# EAGLE design QuadPortIEC (EAGLE 7.7.0)
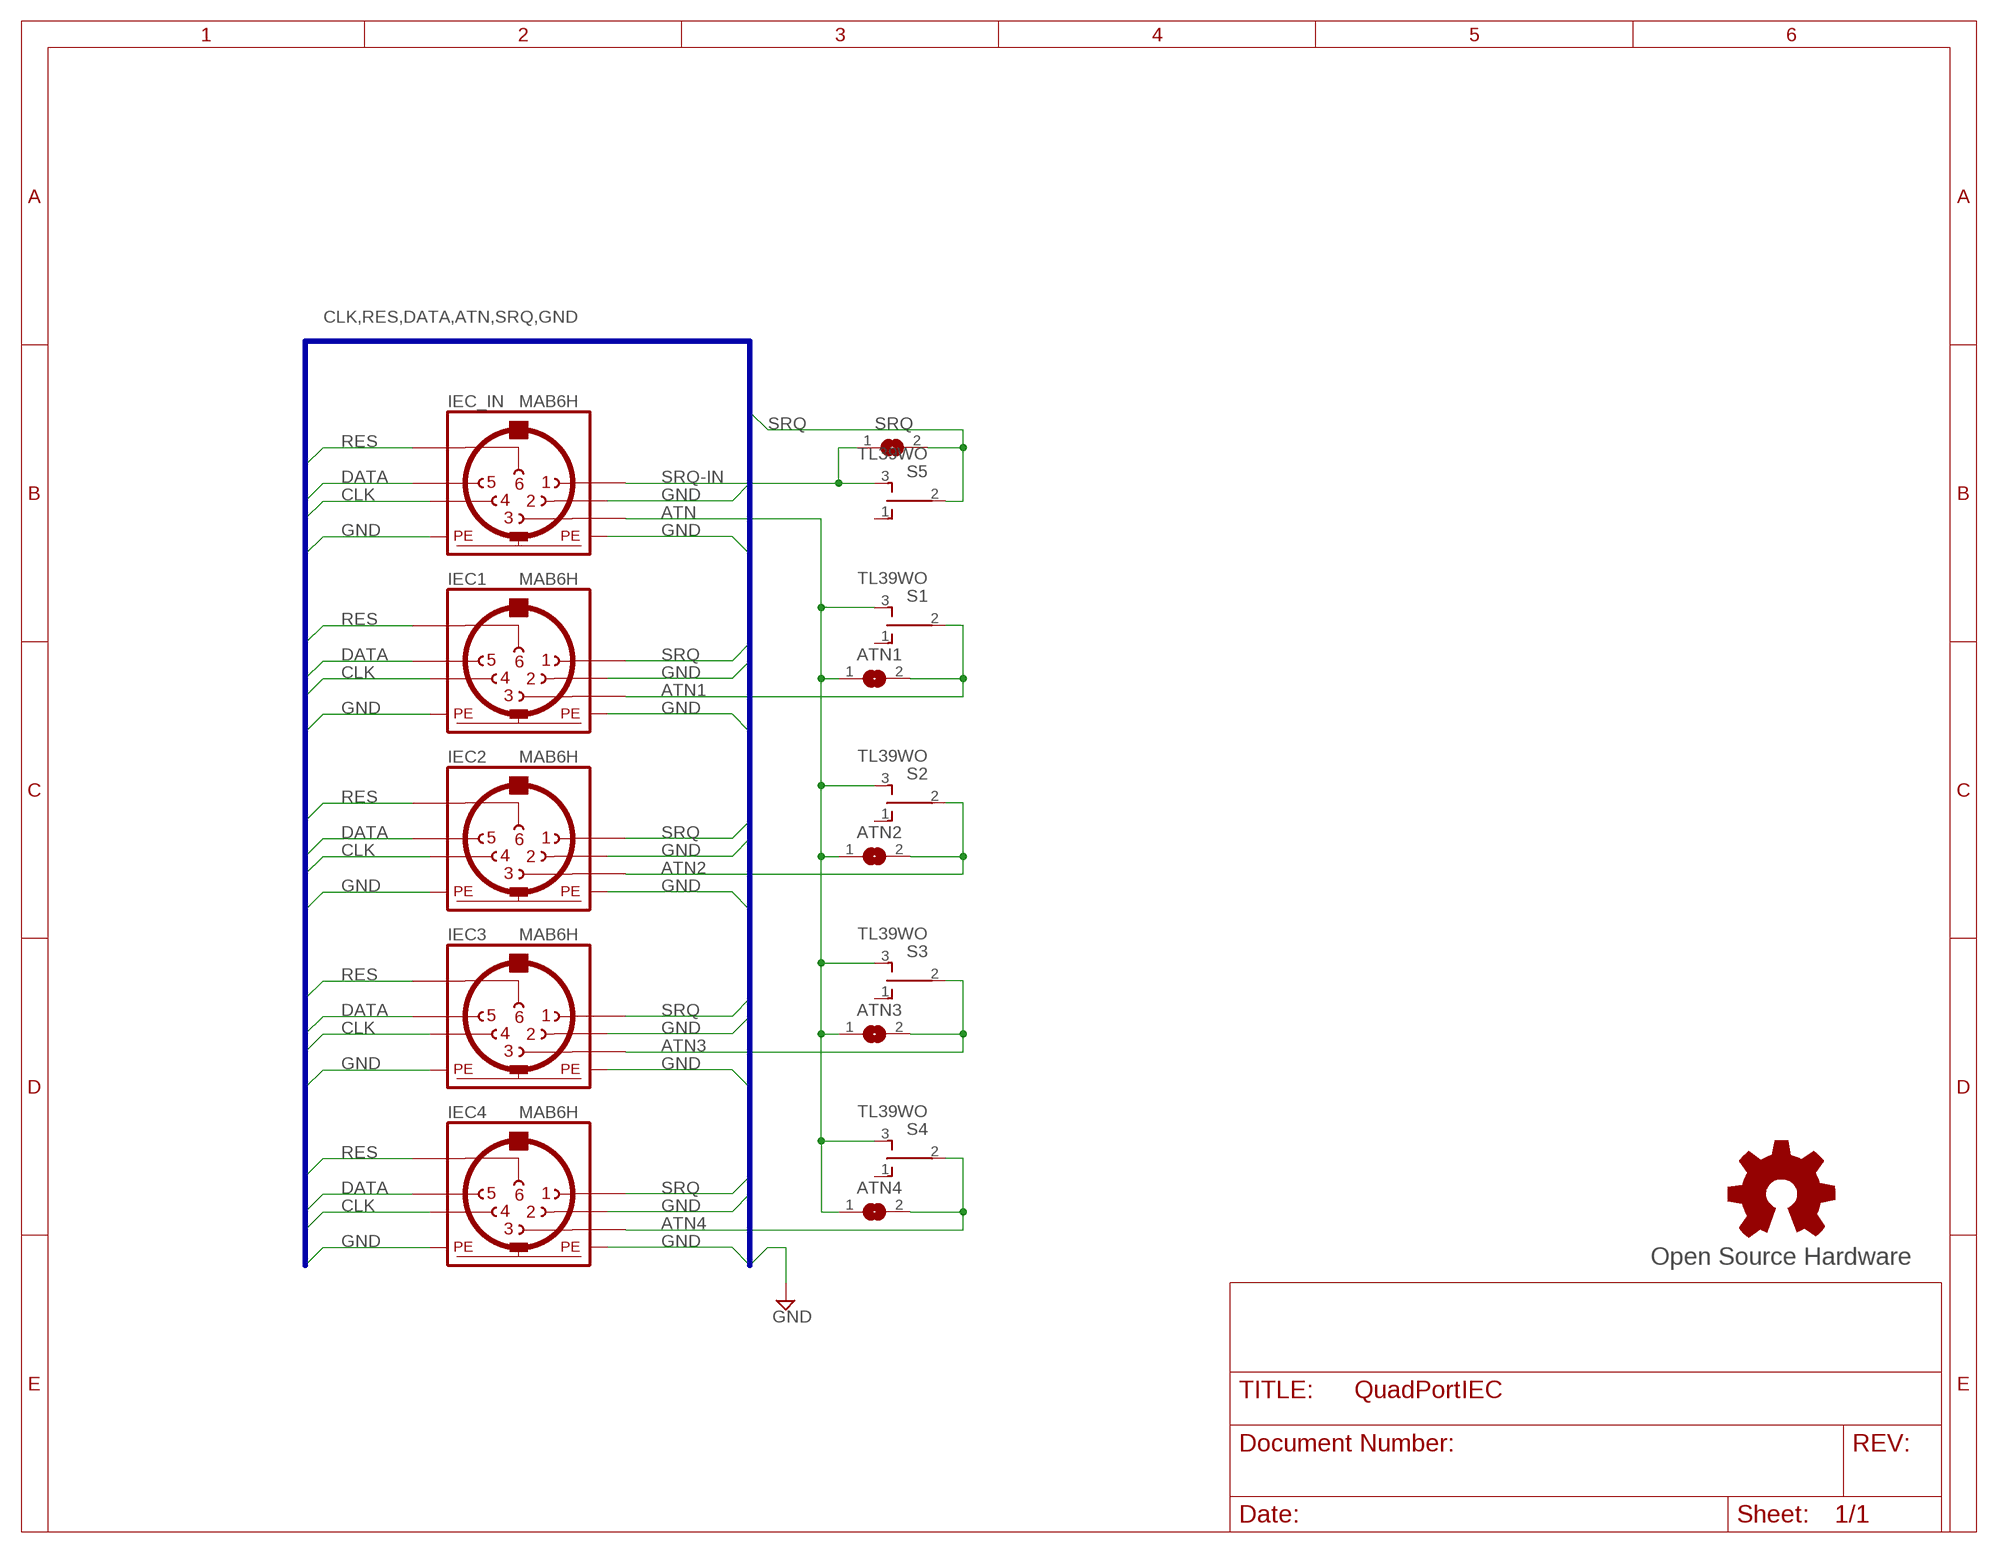
[diagram p0: schematic, sheet 1]

## Parts
ATN1  SJ  [SJ]
ATN2  SJ  [SJ]
ATN3  SJ  [SJ]
ATN4  SJ  [SJ]
GOLD_ORB_SM1  Open Source Hardware  OSHWLOGOLOGO8MM  [OSHW_8MM]
IEC1  MAB6H  [MAB6H]
IEC2  MAB6H  [MAB6H]
IEC3  MAB6H  [MAB6H]
IEC4  MAB6H  [MAB6H]
IEC_IN  MAB6H  [MAB6H]
S1  TL39WO  [TL3XWO]
S2  TL39WO  [TL3XWO]
S3  TL39WO  [TL3XWO]
S4  TL39WO  [TL3XWO]
S5  TL39WO  [TL3XWO]
SRQ  SJ  [SJ]

## Nets
ATN: ATN1.1 ATN2.1 ATN3.1 ATN4.1 IEC_IN.3 S1.3(S) S2.3(S) S3.3(S) S4.3(S)
ATN1: ATN1.2 IEC1.3 S1.2(P)
ATN2: ATN2.2 IEC2.3 S2.2(P)
ATN3: ATN3.2 IEC3.3 S3.2(P)
ATN4: ATN4.2 IEC4.3 S4.2(P)
CLK: IEC1.4 IEC2.4 IEC3.4 IEC4.4 IEC_IN.4
DATA: IEC1.5 IEC2.5 IEC3.5 IEC4.5 IEC_IN.5
GND: IEC1.2 IEC1.PE IEC1.PE@(PE) IEC2.2 IEC2.PE IEC2.PE@(PE) IEC3.2 IEC3.PE IEC3.PE@(PE) IEC4.2 IEC4.PE IEC4.PE@(PE) IEC_IN.2 IEC_IN.PE IEC_IN.PE@(PE)
RES: IEC1.6 IEC2.6 IEC3.6 IEC4.6 IEC_IN.6
SRQ: IEC1.1 IEC2.1 IEC3.1 IEC4.1 S5.2(P) SRQ.2
SRQ-IN: IEC_IN.1 S5.3(S) SRQ.1
Unconnected: S1.1(O) S2.1(O) S3.1(O) S4.1(O) S5.1(O)

## Buses
CLK,RES,DATA,ATN,SRQ,GND

## Library data of the parts
ATN1-ATN4 SRQ = jumper:SJ: SMD solder JUMPER
GOLD_ORB_SM1 = oshw:OSHWLOGO: The OSHW logo for PCB layout
IEC1-IEC4 IEC_IN = con-hirschmann:MAB6H: Female CONNECTOR 6 pins with shield, horizontal (DIN 45322)
S1-S5 = switch:TL39WO: TINY SWITCH ON OFF ON Source: http://www2.produktinfo.conrad.com/datenblaetter/700000-724999/705152-da-01-de-Subminiaturschalter_TL_36WO.pdf

## Board
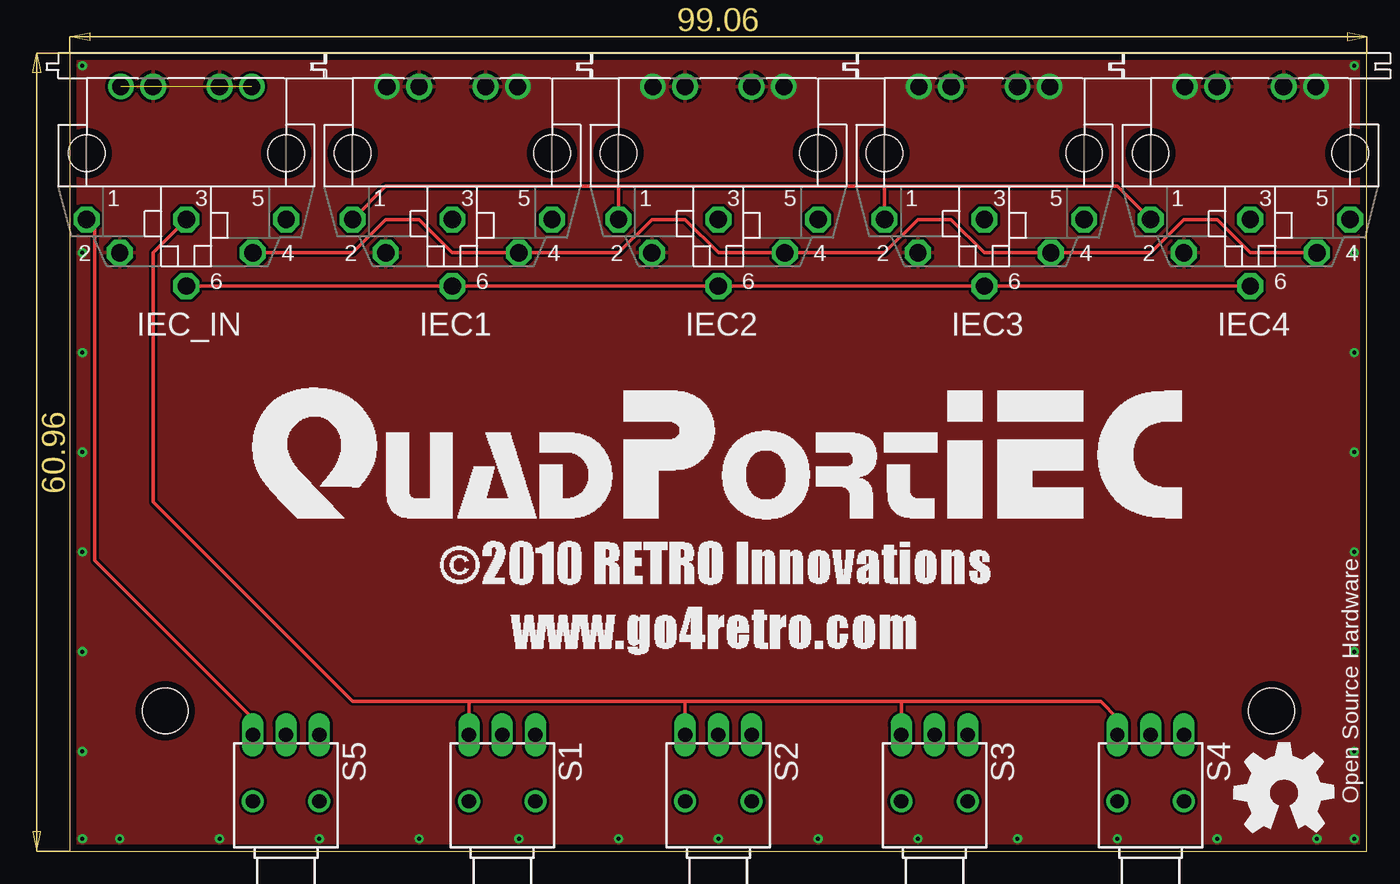
[diagram p1: board, top side]
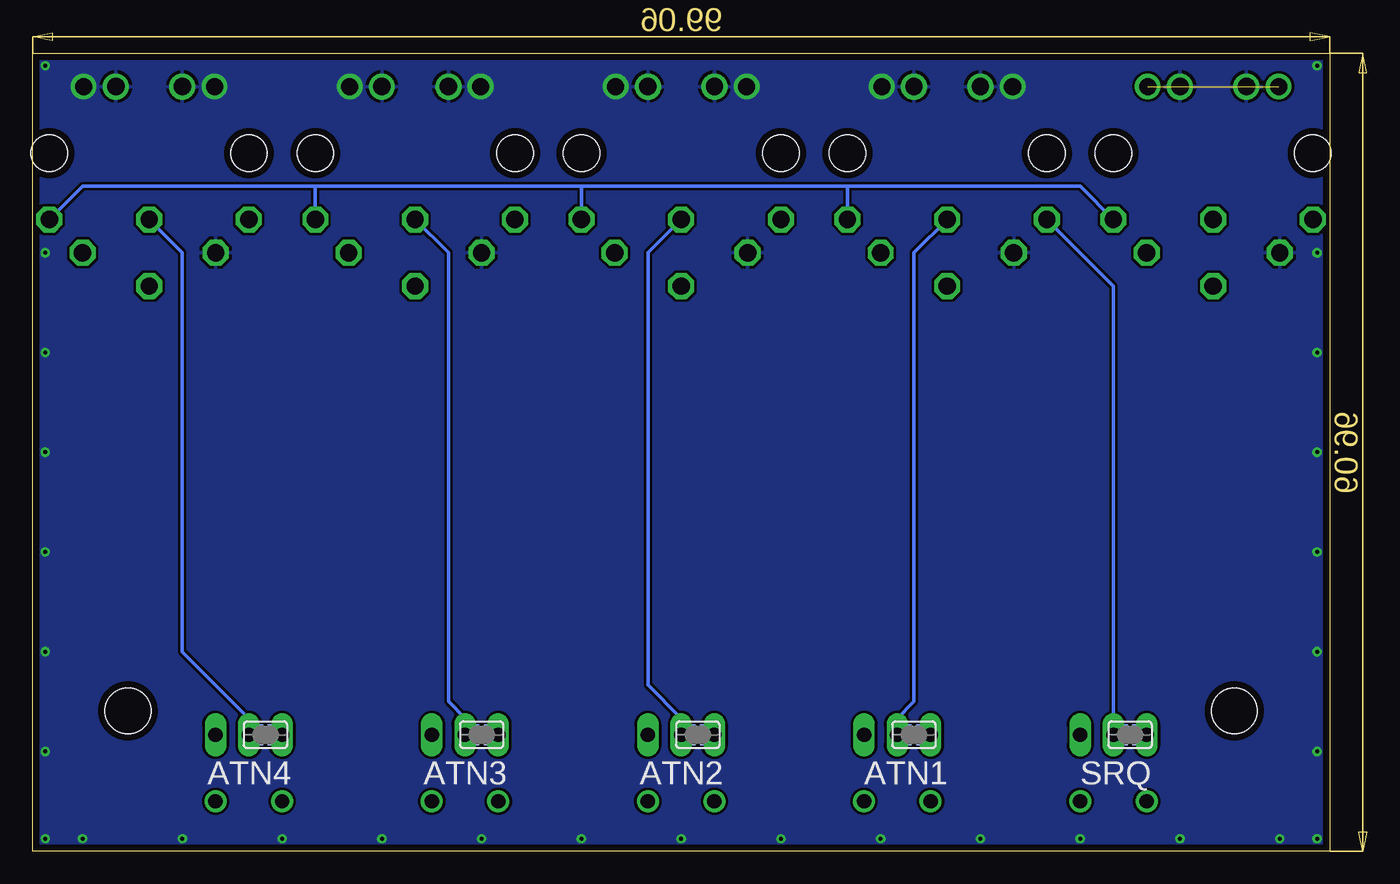
[diagram p2: board, bottom side, seen from below]

Size 99.06 x 60.96 mm. Coordinates in mm from the lower left corner, seen from the top.
Outline: 99.06,60.96 0,60.96 0,0 99.06,0.01 99.06,60.96
Copper layers (1*16): Top 0.035mm / dielectric 1.5mm / Bottom 0.035mm
Design rules "default *": minimum track width 10mil, minimum drill 12mil, track to track 8mil, track to pad 8mil, pad to pad 8mil, via to via 8mil, smd to smd 8mil, copper to edge 20mil, drill to drill 8mil, minimum pad ring 10mil, minimum via ring 8mil, stop-mask expansion 4mil, vias tented up to drill 0mil, thermal gap 10mil
Holes 3.51 mm at 91.78,10.73 7.28,10.73

### Footprints (pad centres in the part's own frame; a part is rotated, then mirrored left to right if it is on the bottom)
SJ = smd 1.168 x 1.6: 1 -0.762,0; 2 0.762,0
MAB6H = drill 1.321 octagon: 1 7.62,5.08; 2 5.08,7.62; 3 0,5.08; 4 -5.08,7.62; 5 -7.62,5.08; 6 0,10.16 | drill 1.321: PE -2.54,-5.08; PE@ 2.54,-5.08 | hole 2.794: 7.62,0; -7.62,0
TL3XWO = drill 1.1 pad 1.422 long: 1 -2.54,-5.08; 2 0,-5.08; 3 2.54,-5.08 | drill 1.1 pad 1.676: M1 -2.54,0; M2 2.54,0

### Placement (x,y rotation side)
ATN1  31.75,8.89 180 bottom
ATN2  48.26,8.89 180 bottom
ATN3  64.77,8.89 180 bottom
ATN4  81.28,8.89 180 bottom
GOLD_ORB_SM1  92.71,4.45 0 top
IEC1  29.21,53.34 180 top
IEC2  49.53,53.34 180 top
IEC3  69.85,53.34 180 top
IEC4  90.17,53.34 180 top
IEC_IN  8.89,53.34 180 top
S1  33.02,3.81 180 top
S2  49.53,3.81 180 top
S3  66.04,3.81 180 top
S4  82.55,3.81 180 top
S5  16.51,3.81 180 top
SRQ  15.24,8.89 180 bottom

### Tracks (layer width: path | path; a pad name or v marks a point on that pad's centre or on a via)
ATN
  Top 0.254: 46.99,11.43 30.48,11.43 | 63.5,11.43 46.99,11.43 | 63.5,11.43 78.74,11.43 80.01,10.16 S4.3 | 46.99,11.43 S2.3 | 63.5,11.43 S3.3 | 30.48,11.43 S1.3 | 30.48,11.43 21.59,11.43 6.35,26.67 6.35,45.72 IEC_IN.3
  Bottom 0.254: S1.3 ATN1.1 | S2.3 ATN2.1 | S3.3 ATN3.1 | S4.3 ATN4.1
ATN1
  Bottom 0.254: IEC1.3 31.75,45.72 31.75,11.43 33.02,10.16 S1.2 ATN1.2
ATN2
  Bottom 0.254: IEC2.3 52.07,45.72 52.07,12.7 49.53,10.16 S2.2 ATN2.2
ATN3
  Bottom 0.254: IEC3.3 67.31,45.72 67.31,11.43 66.04,10.16 S3.2 ATN3.2
ATN4
  Bottom 0.254: IEC4.3 87.63,45.72 87.63,15.24 82.55,10.16 S4.2 ATN4.2
CLK
  Top 0.254: IEC_IN.4 21.59,45.72 24.13,48.26 26.67,48.26 29.21,45.72 IEC1.4 41.91,45.72 44.45,48.26 46.99,48.26 49.53,45.72 IEC2.4 62.23,45.72 64.77,48.26 67.31,48.26 69.85,45.72 IEC3.4 82.55,45.72 85.09,48.26 87.63,48.26 90.17,45.72 IEC4.4
DATA
  Bottom 0.254: IEC_IN.5 19.05,50.8 36.83,50.8 | IEC1.5 36.83,50.8 | 36.83,50.8 57.15,50.8 | 57.15,50.8 IEC2.5 | 57.15,50.8 77.47,50.8 | 77.47,50.8 IEC3.5 | 77.47,50.8 95.25,50.8 IEC4.5
GND  (via drill 0.3, 1.3)
  other vias: 98.11,60.01 98.11,45.72 98.11,38.1 98.11,30.48 98.11,22.86 98.11,15.24 98.11,7.62 98.11,0.95 95.25,0.95 87.63,0.95 80.01,0.95 72.39,0.95 64.77,0.95 57.15,0.95 49.53,0.95 41.91,0.95 34.29,0.95 26.67,0.95 19.05,0.95 11.43,0.95 3.81,0.95 0.95,0.95 0.95,7.62 0.95,15.24 0.95,22.86 0.95,30.48 0.95,45.72 0.95,60.01 0.95,38.1 54.53,58.42 44.53,58.42 34.21,58.42 24.21,58.42 74.85,58.42 64.85,58.42 95.17,58.42 85.17,58.42
  pour Top: 0,60.96 99.06,60.96 99.06,0 0,0
  pour Bottom: 0,60.96 99.06,60.96 99.06,0 0,0
GND4  (via drill 1.3)  (1 unrouted)
  other vias: 13.89,58.42 3.89,58.42
N$1
  Bottom 0.254: 16.51,8.89 13.97,8.89
RES
  Top 0.254: IEC4.6 IEC3.6 IEC2.6 IEC1.6 IEC_IN.6
SRQ
  Top 0.254: IEC4.1 80.01,50.8 62.23,50.8 | 62.23,50.8 IEC3.1 | 41.91,50.8 24.13,50.8 IEC1.1 | 41.91,50.8 62.23,50.8 | 41.91,50.8 IEC2.1
  Bottom 0.254: IEC1.1 16.51,43.18 S5.2 SRQ.2
SRQ-IN
  Top 0.254: IEC_IN.1 1.91,47.62 1.91,22.23 13.97,10.16 S5.3
  Bottom 0.254: S5.3 SRQ.1